# Altium project Tag.PrjPcb
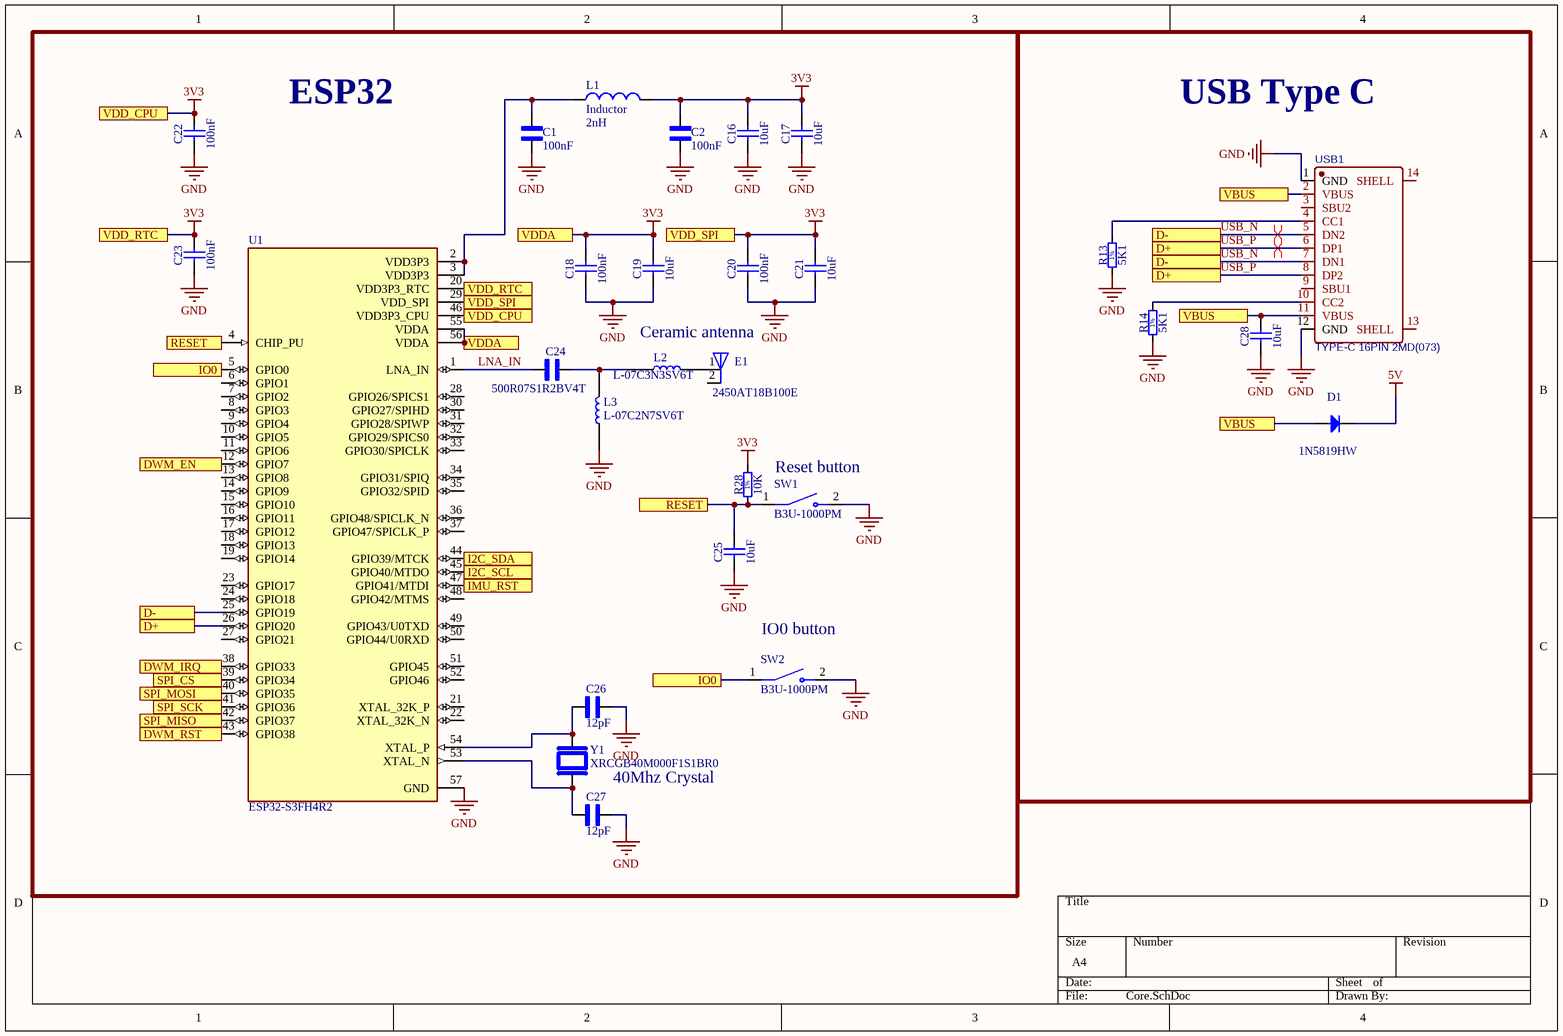
[diagram p0: Core.SchDoc]
3 sheets, 65 parts. Net scope: flat (ports and power ports of the same name join across sheets).
Board file: Tag.PcbDoc
Sheets:
  Core.SchDoc
  UWB_IMU.SchDoc
  Power.SchDoc

## Sheet Core.SchDoc
size A4; SheetNumber: 1; SheetTotal: 3

### Parts
C1  100nF  [CAPC1005X55N]
C2  100nF  [CAPC1005X55N]
C16  10uF  [0603C]
C17  10uF  [0603C]
C18  100nF  [0603C]
C19  10uF  [0603C]
C20  100nF  [0603C]
C21  10uF  [0603C]
C22  100nF  [0603C]
C23  100nF  [0603C]
C24  500R07S1R2BV4T  [CAPC1005X55N]
C25  10uF  [0603C]
C26  12pF  [CAPC1005X55N]
C27  12pF  [CAPC1005X55N]
C28  10uF  [0603C]
D1  1N5819HW  [SOD-123FL]
E1  2450AT18B100E  [XDCR_2450AT18B100E]
L1  Inductor  value 2nH  [0402-A]
L2  L-07C3N3SV6T  [INDC1005X60N]
L3  L-07C2N7SV6T  [INDC1005X60N]
R13  5K1  [0603R]
R14  5K1  [0603R]
R28  10K  [0603R]
SW1  B3U-1000PM  [SW_B3U-1000PM]
SW2  B3U-1000PM  [SW_B3U-1000PM]
U1  ESP32-S3FH4R2  [QFN40P700X700X90-57N]
USB1  TYPE-C 16PIN 2MD(073)  [USB-C-SMD_TYPE-C-6PIN-2MD-073]
Y1  XRCGB40M000F1S1BR0  [OSC_XRCGB40M000F1S1BR0]

### Blocks framed on the sheet
ESP32: C1 C2 C16-C27 E1 L1-L3 R28 SW1 SW2 U1 Y1
USB Type C: C28 D1 R13 R14 USB1

### Ports
D+, D-, DWM_EN, DWM_IRQ, DWM_RST, I2C_SCL, I2C_SDA, IMU_RST, IO0, RESET, SPI_CS, SPI_MISO, SPI_MOSI, SPI_SCK, VBUS, VDD_CPU, VDD_RTC, VDD_SPI, VDDA

### Nets
3V3: C2.2 C16.2 C17.2 C18.2 C19.2 C20.2 C21.2 C22.2 C23.2 L1.2 R28.2 U1.20(VDD3P3_RTC) U1.29(VDD_SPI) U1.46(VDD3P3_CPU) U1.55(VDDA) U1.56(VDDA) ; port VDDA, port VDD_CPU, port VDD_SPI, port VDD_RTC
5V: D1.1(C)
GND: C1.1 C2.1 C16.1 C17.1 C18.1 C19.1 C20.1 C21.1 C22.1 C23.1 C25.1 C26.2 C27.2 C28.1 L3.1 R13.1 R14.1 SW1.2 SW2.2 U1.57(GND) USB1.1(GND) USB1.12(GND)
LNA_IN: C24.1 U1.1(LNA_IN)
USB_N: U1.25(GPIO19) USB1.5(DN2) USB1.7(DN1) ; port D-
USB_P: U1.26(GPIO20) USB1.6(DP1) USB1.8(DP2) ; port D+
NetC1_2: C1.2 L1.1 U1.2(VDD3P3) U1.3(VDD3P3)
NetC24_2: C24.2 L2.1 L3.2
NetC25_2: C25.2 R28.1 SW1.1 U1.4(CHIP_PU) ; port RESET
NetC26_1: C26.1 U1.54(XTAL_P) Y1.1
NetC27_1: C27.1 U1.53(XTAL_N) Y1.3
NetC28_2: C28.2 D1.2(A) USB1.2(VBUS) USB1.11(VBUS) ; port VBUS
NetE1_1: E1.1(FEED) L2.2
NetR3_1: U1.38(GPIO33) ; port DWM_IRQ
NetR10_2: U1.12(GPIO7) ; port DWM_EN
NetR13_2: R13.2 USB1.4(CC1)
NetR14_2: R14.2 USB1.10(CC2)
NetR26_1: U1.45(GPIO40/MTDO) ; port I2C_SCL
NetR27_1: U1.44(GPIO39/MTCK) ; port I2C_SDA
NetSW2_1: SW2.1 U1.5(GPIO0) ; port IO0
NetU1_39: U1.39(GPIO34) ; port SPI_CS
NetU1_40: U1.40(GPIO35) ; port SPI_MOSI
NetU1_41: U1.41(GPIO36) ; port SPI_SCK
NetU1_42: U1.42(GPIO37) ; port SPI_MISO
NetU1_43: U1.43(GPIO38) ; port DWM_RST
NetU1_47: U1.47(GPIO41/MTDI) ; port IMU_RST

Not connected (* = marked no-connect by the designer): E1 2(NC); U1 6(GPIO1) 7(GPIO2) 8(GPIO3) 9(GPIO4) 10(GPIO5) 11(GPIO6) 13(GPIO8) 14(GPIO9) 15(GPIO10) 16(GPIO11) 17(GPIO12) 18(GPIO13) 19(GPIO14) 21(XTAL_32K_P) 22(XTAL_32K_N) 23(GPIO17) 24(GPIO18) 27(GPIO21) 28(GPIO26/SPICS1) 30(GPIO27/SPIHD) 31(GPIO28/SPIWP) 32(GPIO29/SPICS0) 33(GPIO30/SPICLK) 34(GPIO31/SPIQ) 35(GPIO32/SPID) 36(GPIO48/SPICLK_N) 37(GPIO47/SPICLK_P) 48(GPIO42/MTMS) 49(GPIO43/U0TXD) 50(GPIO44/U0RXD) 51(GPIO45) 52(GPIO46); USB1 3(SBU2) 9(SBU1) 13(SHELL) 14(SHELL)

### Layout directives
differential pair: USB_N, USB_P

### Notes on the sheet
- Ceramic antenna
- Reset button
- (near SW2) IO0 button
- 40Mhz Crystal
- (in symbol Resistor - 1%_1) 1%

### Library data of the parts
C1 C2 C26 C27 = 0402N100J500CT: 10 pF Â±5% 50V Ceramic Capacitor C0G, NP0 0402 (1005 Metric); MF: Walsin Technology; SnapEDA_Link: https://www.snapeda.com/parts/0402N100J500CT/Walsin+Technologies/view-part/?ref=snap; Package: 0402 Walsin Technologies; Value: *; MP: 0402N100J500CT; Check_prices: https://www.snapeda.com/parts/0402N100J500CT/Walsin+Technologies/view-part/?ref=eda
C16-C23 C25 C28 = Capacitor - non polarized: Non-polarised capacitor
C24 = 500R07S1R2BV4T: 1.2 pF Â±0.1pF 50V Ceramic Capacitor C0G, NP0 0402 (1005 Metric); MF: Johanson Technology; SnapEDA_Link: https://www.snapeda.com/parts/500R07S1R2BV4T/Johanson/view-part/?ref=snap; Package: 0402 Johanson; Value: *; MP: 500R07S1R2BV4T; Check_prices: https://www.snapeda.com/parts/500R07S1R2BV4T/Johanson/view-part/?ref=eda
D1 = Diode A1C3: Diode Anode Pin 1 Cathode Pin 3 (Pas de pin 2)
E1 = 2450AT18B100E: 2.4GHz - Chip RF Antenna 2.4GHz ~ 2.5GHz 0.5dBi Solder Surface Mount; MF: Johanson Technology; Price: None; Package: None; Purchase-URL: https://pricing.snapeda.com/search/part/2450AT18B100E/?ref=eda; MP: 2450AT18B100E; Availability: In Stock; SnapEDA_Link: https://www.snapeda.com/parts/2450AT18B100E/Johanson+Technology+Inc./view-part/?ref=snap; Check_prices: https://www.snapeda.com/parts/2450AT18B100E/Johanson+Technology+Inc./view-part/?ref=eda; Value: *
L1 = Inductor: Code_IEC: 1005; Published: 8-Jun-2000; LatestRevisionDate: 29-May-2009; LatestRevisionNote: IPC-7351 Footprint Added.; PackageReference: 0402-A; Publisher: Altium Limited; PackageDescription: Chip Inductor; Code_JEITA: 0402
L2 L3 = L-07C3N3SV6T: 3.3 nH Unshielded Multilayer Inductor 300 mA 190mOhm Max 0402 (1005 Metric); MF: Johanson Technology; SnapEDA_Link: https://www.snapeda.com/parts/L-07C3N3SV6T/Johanson/view-part/?ref=snap; Package: SMD-2 JOHANSON; Value: *; MP: L-07C3N3SV6T; Check_prices: https://www.snapeda.com/parts/L-07C3N3SV6T/Johanson/view-part/?ref=eda
R13 R14 R28 = Resistor - 1%_1: Resistor - 1%
SW1 SW2 = B3U-1000PM: Top, w/o Boss 1k Reel | Omron Electronic Components B3U-1000PM; SnapEDA_Link: https://www.snapeda.com/parts/B3U-1000PM/Omron/view-part/?ref=snap; Package: Custom Package Omron; Value: *; MF: Omron; MP: B3U-1000PM; Check_prices: https://www.snapeda.com/parts/B3U-1000PM/Omron/view-part/?ref=eda
U1 = ESP32-S3FH4R2: RF System on a Chip - SoC SMD IC ESP32-S3FH4R2, dual-core MCU, Wi-Fi 2.4G & BLE 5.0 combo, 4 MB flash and 2 MB PSRAM inside, QFN 56-pin, 7*7 mm; MF: Espressif Systems; SnapEDA_Link: https://www.snapeda.com/parts/ESP32-S3FH4R2/Espressif+Systems/view-part/?ref=snap; Package: None; Value: *; MP: ESP32-S3FH4R2; Check_prices: https://www.snapeda.com/parts/ESP32-S3FH4R2/Espressif+Systems/view-part/?ref=eda
USB1 = TYPE-C 16PIN 2MD(073): Manufacturer: SHOU HAN(首韩); Contributor: LCSC; Supplier: LCSC; Supplier Part: C2765186; Manufacturer Part: TYPE-C 16PIN 2MD(073); JLCPCB Part Class: Extended Part; spicePre: U; spiceSymbolName: TYPE-C 16PIN 2MD(073)
Y1 = XRCGB40M000F1S1BR0: Crystal 40MHz Â±10ppm (Tol) Â±10ppm (Stability) 8pF 50Ohm 4-Pin CSMD T/R; MF: Murata Electronics; Purchase-URL: https://pricing.snapeda.com/search/part/XRCGB40M000F1S1BR0/?ref=eda; Package: SMD-4 Murata; Check_prices: https://www.snapeda.com/parts/XRCGB40M000F1S1BR0/Murata/view-part/4980411/?ref=eda; Value: *; SnapEDA_Link: https://www.snapeda.com/parts/XRCGB40M000F1S1BR0/Murata/view-part/4980411/?ref=snap; MP: XRCGB40M000F1S1BR0; Digi-Key_Part_Number: 490-XRCGB40M000F1S1BR0TR-ND

## Sheet UWB_IMU.SchDoc
size A4; SheetNumber: 2; SheetTotal: 3
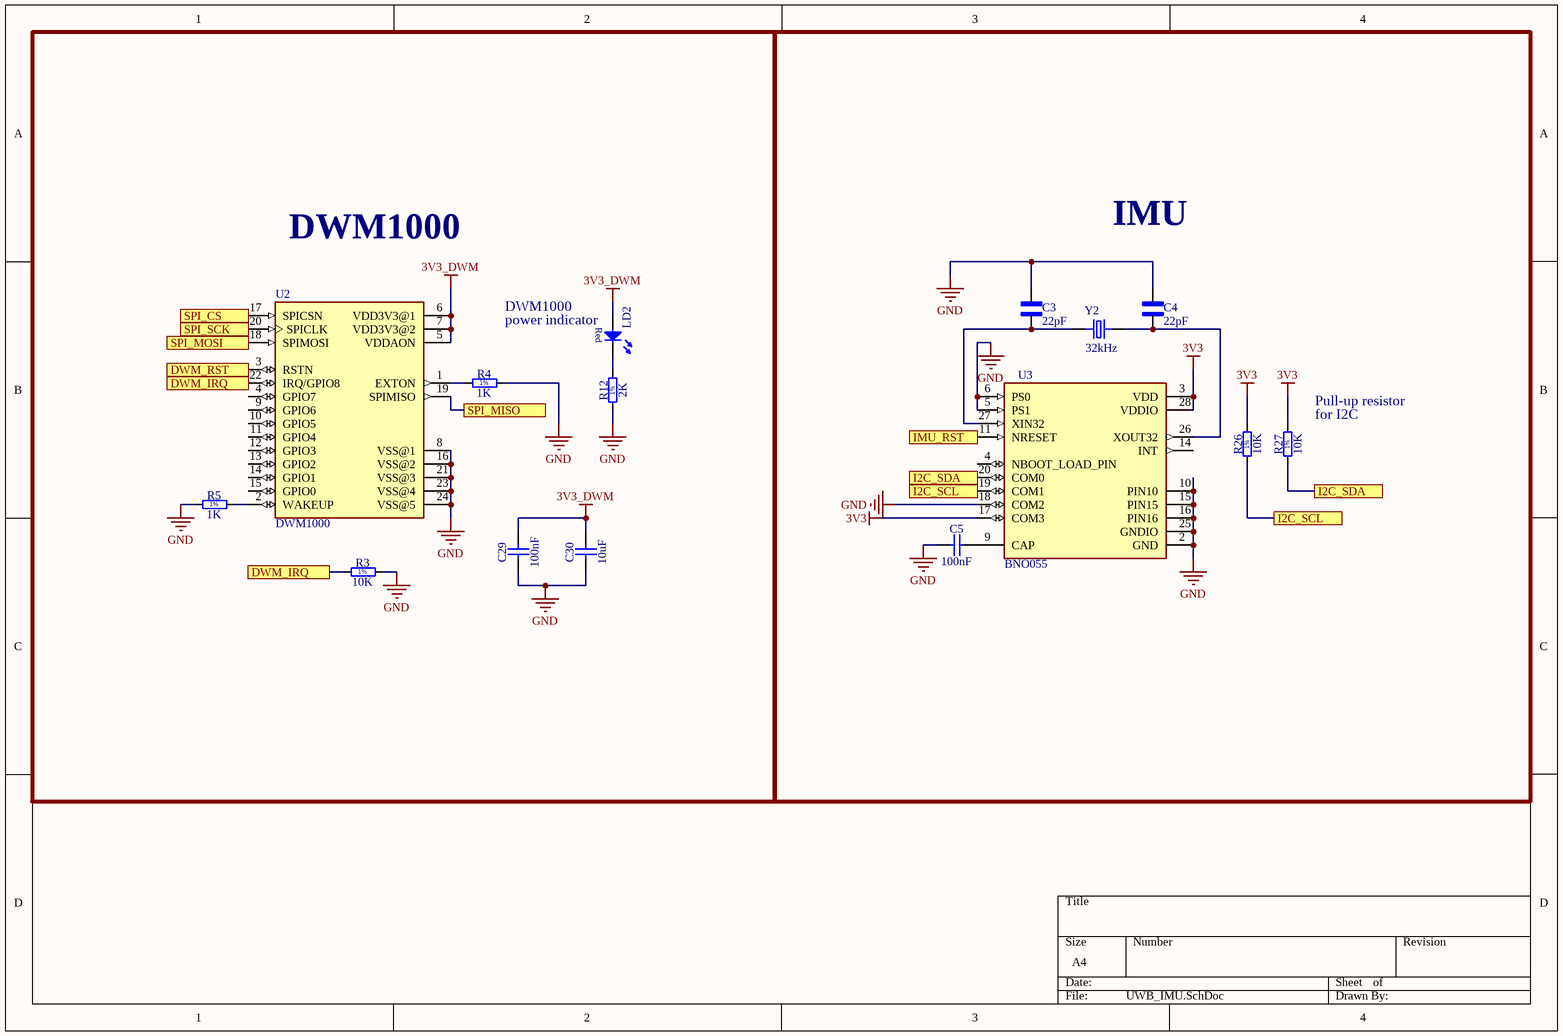
[diagram p1: UWB_IMU.SchDoc]

### Parts
C3  22pF  [CAPC1005X55N]
C4  22pF  [CAPC1005X55N]
C5  100nF  [0603C]
C29  100nF  [0603C]
C30  10uF  [0603C]
LD2  (no value)  [0603 LED]
R3  10K  [0603R]
R4  1K  [0603R]
R5  1K  [0603R]
R12  2K  [0603R]
R26  10K  [0603R]
R27  10K  [0603R]
U2  DWM1000  [XCVR_DWM1000]
U3  BNO055  [LGA28R50P4X10_380X520X100]
Y2  32kHz  [XTAL_ECS-.327-6-34RR-TR]

### Blocks framed on the sheet
DWM1000: C29 C30 LD2 R3-R5 R12 U2
IMU: C3-C5 R26 R27 U3 Y2

### Ports
DWM_IRQ, DWM_RST, I2C_SCL, I2C_SDA, IMU_RST, SPI_CS, SPI_MISO, SPI_MOSI, SPI_SCK

### Nets
3V3: R26.2 R27.2 U3.3(VDD) U3.17(COM3) U3.28(VDDIO)
3V3_DWM: C29.2 C30.2 LD2.2(A) U2.5(VDDAON) U2.6(VDD3V3@1) U2.7(VDD3V3@2)
GND: C3.2 C4.2 C5.1 C29.1 C30.1 R3.2 R4.2 R5.1 R12.1 U2.8(VSS@1) U2.16(VSS@2) U2.21(VSS@3) U2.23(VSS@4) U2.24(VSS@5) U3.2(GND) U3.5(PS1) U3.6(PS0) U3.10(PIN10) U3.15(PIN15) U3.16(PIN16) U3.18(COM2) U3.25(GNDIO)
NetC3_1: C3.1 U3.27(XIN32) Y2.1(I/O)
NetC4_1: C4.1 U3.26(XOUT32) Y2.2(O/I)
NetC5_2: C5.2 U3.9(CAP)
NetLD2_1: LD2.1(C) R12.2
NetR3_1: R3.1 U2.22(IRQ/GPIO8) ; port DWM_IRQ
NetR4_1: R4.1 U2.1(EXTON)
NetR5_2: R5.2 U2.2(WAKEUP)
NetR26_1: R26.1 U3.19(COM1) ; port I2C_SCL
NetR27_1: R27.1 U3.20(COM0) ; port I2C_SDA
NetU1_39: U2.17(SPICSN) ; port SPI_CS
NetU1_40: U2.18(SPIMOSI) ; port SPI_MOSI
NetU1_41: U2.20(SPICLK) ; port SPI_SCK
NetU1_42: U2.19(SPIMISO) ; port SPI_MISO
NetU1_43: U2.3(RSTN) ; port DWM_RST
NetU1_47: U3.11(NRESET) ; port IMU_RST

Not connected (* = marked no-connect by the designer): U2 4(GPIO7) 9(GPIO6) 10(GPIO5) 11(GPIO4) 12(GPIO3) 13(GPIO2) 14(GPIO1) 15(GPIO0); U3 4(NBOOT_LOAD_PIN) 14(INT)

### Notes on the sheet
- DWM1000
- (near LD2) power indicator
- (near R27) Pull-up resistor
- (near R27) for I2C
- (in symbol LED Red 1C 2A) Red
- (in symbol Resistor - 1%_1) 1%

### Library data of the parts
C3 C4 = 0402N100J500CT: as C1 on sheet Core; SnapEDA_Link: https://www.snapeda.com/parts/0402N100J500CT/Walsin+Technologies/view-part/?ref=snap; Package: 0402 Walsin Technologies; Value: *; MP: 0402N100J500CT; Check_prices: https://www.snapeda.com/parts/0402N100J500CT/Walsin+Technologies/view-part/?ref=eda
C5 C29 C30 = Capacitor - non polarized: Non-polarised capacitor
LD2 = LED Red 1C 2A
R3-R5 R12 R26 R27 = Resistor - 1%_1: Resistor - 1%
U2 = DWM1000: 802.15.4 IR-UWB Transceiver Module 3.5GHz ~ 6.5GHz Integrated, Chip Surface Mount; MF: Decawave Limited; Package: Module Decawave; Availability: Unavailable; Value: *; MP: DWM1000; SnapEDA_Link: https://www.snapeda.com/parts/DWM1000/Decawave%20Limited/view-part/327593/?ref=snap; Price: None
U3 = BNO055: BNO055 9-axis Absolute Orientation Sensor ( SiP ) w/Sensors and Sensor Fusion; Package: None; Price: None; Value: *; MP: BNO055; Availability: Unavailable
Y2 = ECS-.327-6-34RR-TR: 32.768kHz 20ppm Crystal 6pF 20 kOhm -40C ~ 85C Surface Mount 2-SMD, No Lead 3.2 x 1.5; MF: ECS Inc.; SnapEDA_Link: https://www.snapeda.com/parts/ECS-.327-6-34RR-TR/ECS/view-part/?ref=snap; Package: ECX-34RR-34RR-2 ECS; Value: *; MP: ECS-.327-6-34RR-TR; Check_prices: https://www.snapeda.com/parts/ECS-.327-6-34RR-TR/ECS/view-part/?ref=eda

## Sheet Power.SchDoc
size A4; SheetNumber: 3; SheetTotal: 3
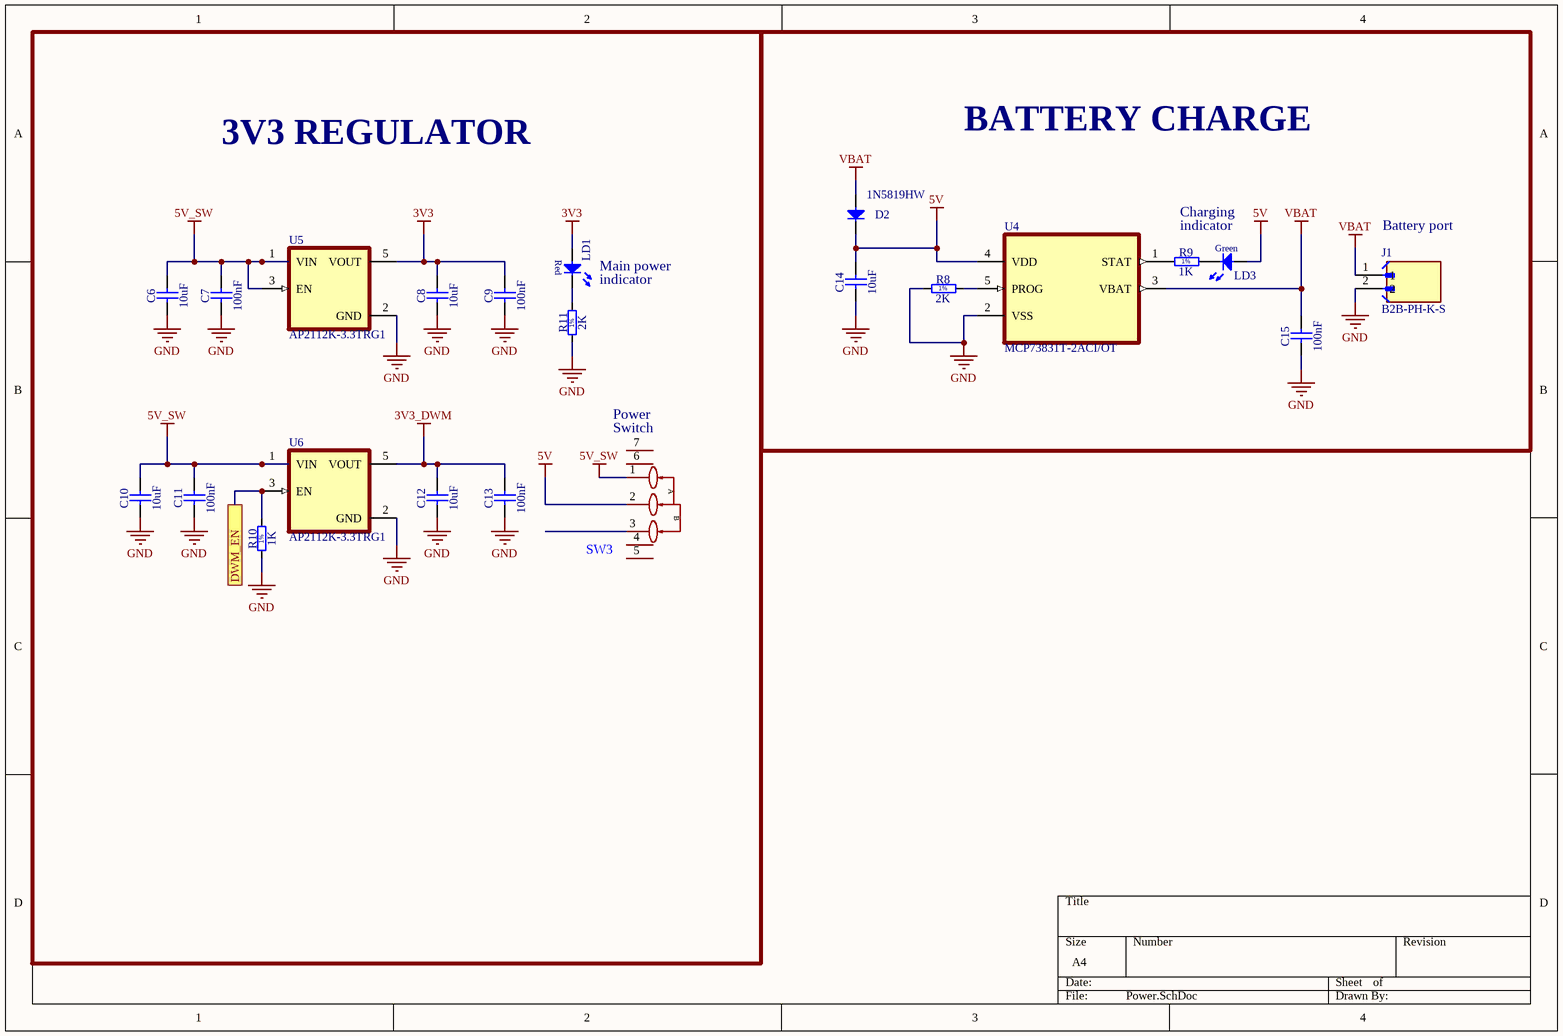
[diagram p2: Power.SchDoc]

### Parts
C6  10uF  [0603C]
C7  100nF  [0603C]
C8  10uF  [0603C]
C9  100nF  [0603C]
C10  10uF  [0603C]
C11  100nF  [0603C]
C12  10uF  [0603C]
C13  100nF  [0603C]
C14  10uF  [0603C]
C15  100nF  [0603C]
D2  1N5819HW  [SOD-123FL]
J1  B2B-PH-K-S  [JST_B2B-PH-K-S]
LD1  (no value)  [0603 LED]
LD3  GREEN  [0603 LED]  (value not drawn)
R8  2K  [0603R]
R9  1K  [0603R]
R10  1K  [0603R]
R11  2K  [0603R]
SW3  MK-12C02-G020  [SW-SMD_MK-12C02-G020]  (value not drawn)
U4  MCP73831T-2ACI/OT  [SOT95P280X145-5N]
U5  AP2112K-3.3TRG1  [SOT95P285X140-5N]
U6  AP2112K-3.3TRG1  [SOT95P285X140-5N]

### Blocks framed on the sheet
3V3 REGULATOR: C6-C13 LD1 R10 R11 SW3 U5 U6
BATTERY CHARGE: C14 C15 D2 J1 LD3 R8 R9 U4

### Ports
DWM_EN

### Nets
3V3: C8.2 C9.2 LD1.2(A) U5.5(VOUT)
3V3_DWM: C12.2 C13.2 U6.5(VOUT)
5V: C14.2 D2.1(C) LD3.2(A) SW3.2 U4.4(VDD)
5V_SW: C6.2 C7.2 C10.2 C11.2 SW3.1 U5.1(VIN) U5.3(EN) U6.1(VIN)
GND: C6.1 C7.1 C8.1 C9.1 C10.1 C11.1 C12.1 C13.1 C14.1 C15.1 J1.2 R8.1 R10.1 R11.1 U4.2(VSS) U5.2(GND) U6.2(GND)
VBAT: C15.2 D2.2(A) J1.1 U4.3(VBAT)
NetLD1_1: LD1.1(C) R11.2
NetLD3_1: LD3.1(C) R9.2
NetR8_2: R8.2 U4.5(PROG)
NetR9_1: R9.1 U4.1(STAT)
NetR10_2: R10.2 U6.3(EN) ; port DWM_EN

Not connected (* = marked no-connect by the designer): SW3 3 4 5 6 7

### Notes on the sheet
- Charging
- indicator
- (near J1) Battery port
- Main power
- (near SW3) Switch
- (near SW3) Power
- (in symbol LED Green 1C 2A) Green
- (in symbol LED Red 1C 2A) Red
- (in symbol MK-12C02-G020) A; B
- (in symbol Resistor - 1%_1) 1%

### Library data of the parts
C6-C15 = Capacitor - non polarized: Non-polarised capacitor
D2 = Diode A1C3: as D1 on sheet Core
J1 = B2B-PH-K-S: Connector Header Through Hole 2 position 0.079 (2.00mm); MF: JST Sales America Inc.; SnapEDA_Link: https://www.snapeda.com/parts/B2B-PH-K-S/JST/view-part/?ref=snap; Package: None; Value: *; MP: B2B-PH-K-S; Check_prices: https://www.snapeda.com/parts/B2B-PH-K-S/JST/view-part/?ref=eda
LD1 = LED Red 1C 2A
LD3 = LED Green 1C 2A
R8-R11 = Resistor - 1%_1: Resistor - 1%
SW3 = MK-12C02-G020: Manufacturer: G-Switch(品赞); Add into BOM: yes; Circuit: SPDT; Actuator Style: Rectangular Columnar; Switch Height: 4.7mm; Actuator Color: Black; Current Rating: 1A; Voltage Rating: 6V; Life: 10,000 Cycles; Symbol: MK-12C02-G020; Device: MK-12C02-G020; LCSC Part Name: 微型拨动开关; Supplier Part: C963206; Manufacturer Part: MK-12C02-G020; Supplier Footprint: SMD,6.6x1.4mm; JLCPCB Part Class: Extended Part; Datasheet: https://item.szlcsc.com/datasheet/MK-12C02-G020/1046841.html; Supplier: LCSC; Convert to PCB: yes; Termination Style: -; Length: 6.6mm; Width: 1.4mm; Mounting Type: Surface Mount, Right Angle; Operating Temperature: -20℃~+70℃
U4 = MCP73831T-2ACI/OT: Charger IC Lithium Ion/Polymer SOT-23-5; MF: Microchip; Package: SOT-23 Microchip; Purchase-URL: https://pricing.snapeda.com/search/part/MCP73831T-2ACI/OT/?ref=eda; MP: MCP73831T-2ACI/OT; Value: *; Availability: In Stock; SnapEDA_Link: https://www.snapeda.com/parts/MCP73831T-2ACI/OT/Microchip/view-part/?ref=snap; Price: None; Check_prices: https://www.snapeda.com/parts/MCP73831T-2ACI/OT/Microchip/view-part/?ref=eda
U5 U6 = AP2112K-3.3TRG1: Linear Voltage Regulator IC Positive Fixed 1 Output 600mA SOT-25; MF: Diodes Inc.; Value: *; Purchase-URL: https://pricing.snapeda.com/search/part/AP2112K-3.3TRG1/?ref=eda; Package: SOT-753 Diodes Inc.; Availability: In Stock; Check_prices: https://www.snapeda.com/parts/AP2112K-3.3TRG1/Diodes+Inc./view-part/?ref=eda; Price: None; SnapEDA_Link: https://www.snapeda.com/parts/AP2112K-3.3TRG1/Diodes+Inc./view-part/?ref=snap; MP: AP2112K-3.3TRG1

## Nets that join several sheets
3V3: Core (16 pins), UWB_IMU (5 pins), Power (C8.2 C9.2 LD1.2 U5.5)
3V3_DWM: UWB_IMU (6 pins), Power (C12.2 C13.2 U6.5)
5V: Core (D1.1), Power (5 pins)
GND: Core (22 pins), UWB_IMU (22 pins), Power (17 pins)
NetR3_1: Core (U1.38), UWB_IMU (R3.1 U2.22)
NetR10_2: Core (U1.12), Power (R10.2 U6.3)
NetR26_1: Core (U1.45), UWB_IMU (R26.1 U3.19)
NetR27_1: Core (U1.44), UWB_IMU (R27.1 U3.20)
NetU1_39: Core (U1.39), UWB_IMU (U2.17)
NetU1_40: Core (U1.40), UWB_IMU (U2.18)
NetU1_41: Core (U1.41), UWB_IMU (U2.20)
NetU1_42: Core (U1.42), UWB_IMU (U2.19)
NetU1_43: Core (U1.43), UWB_IMU (U2.3)
NetU1_47: Core (U1.47), UWB_IMU (U3.11)